# Altium schematic sheet 01.Index.SchDoc
size A3; SheetNumber: 1; SheetTotal: 4
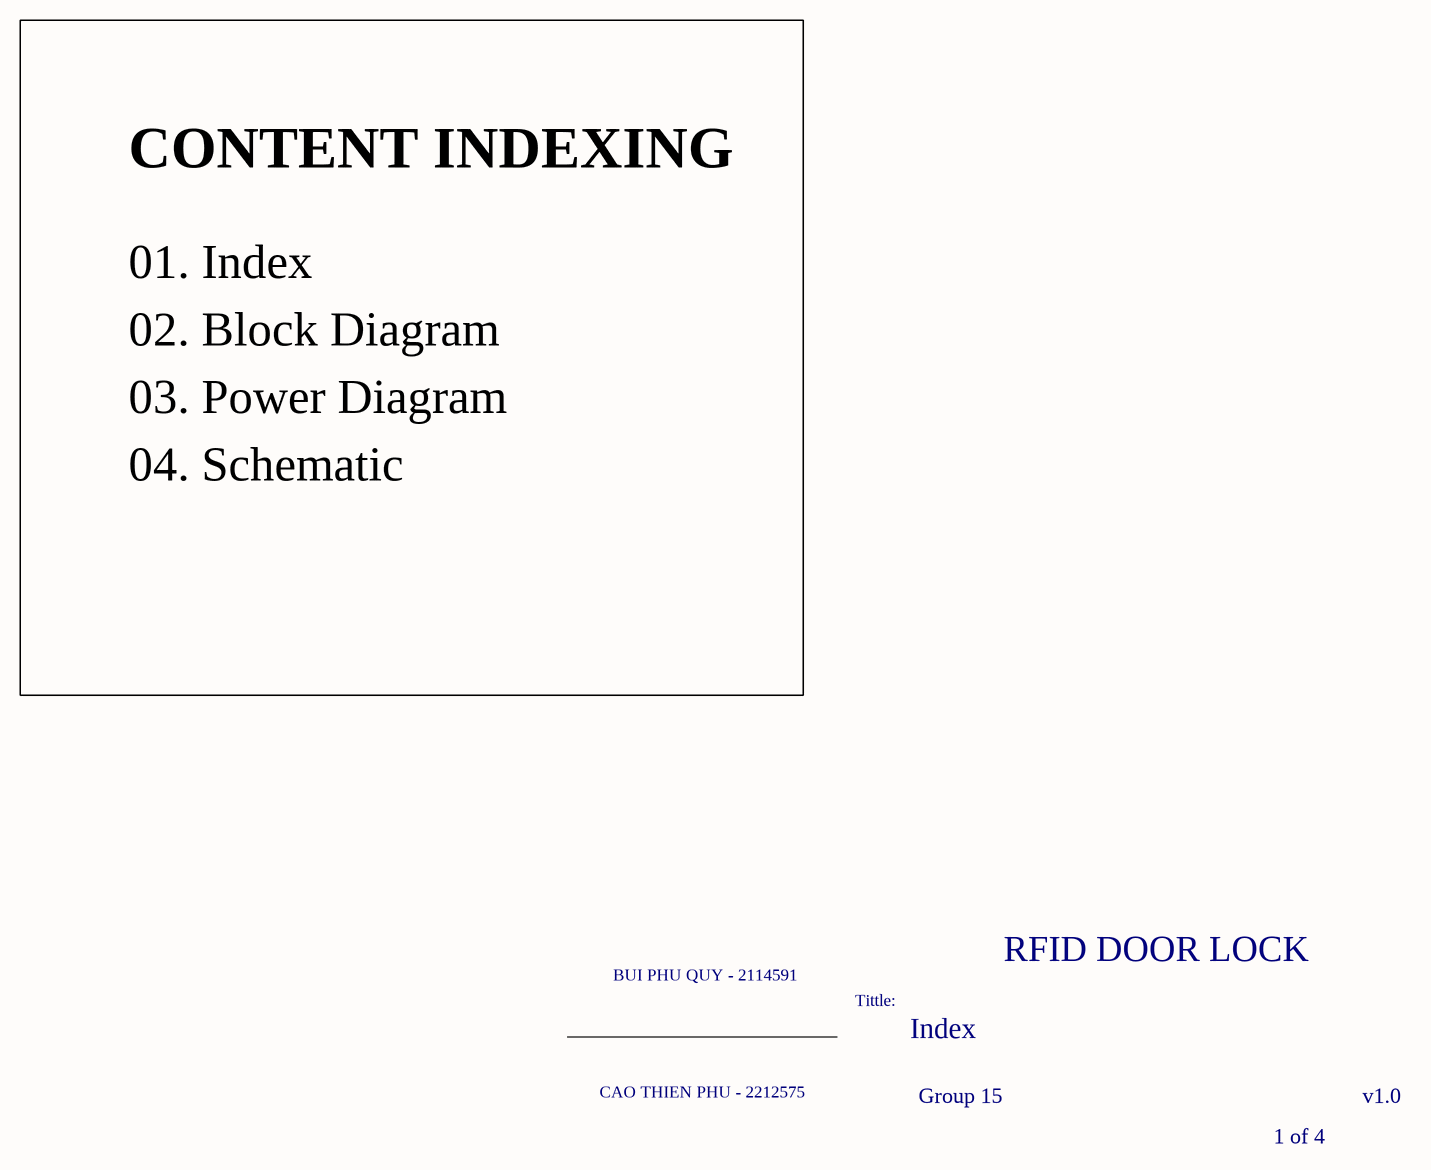
[diagram p0: 01.Index.SchDoc]

## Notes on the sheet
- CONTENT INDEXING
- 01. Index
- 02. Block Diagram
- 03. Power Diagram
- 04. Schematic
- BUI PHU QUY - 2114591
- Tittle:
- RFID DOOR LOCK
- Index
- CAO THIEN PHU - 2212575
- Group 15
- v1.0
- 1 of 4